# Altium schematic sheet Led_Matrix_3.SchDoc
size A3; CompanyName: Anfaengineering; Organization: Anfaengineering; Address1: Timisoara; Address2: Romania; SheetNumber: 5; SheetTotal: 5
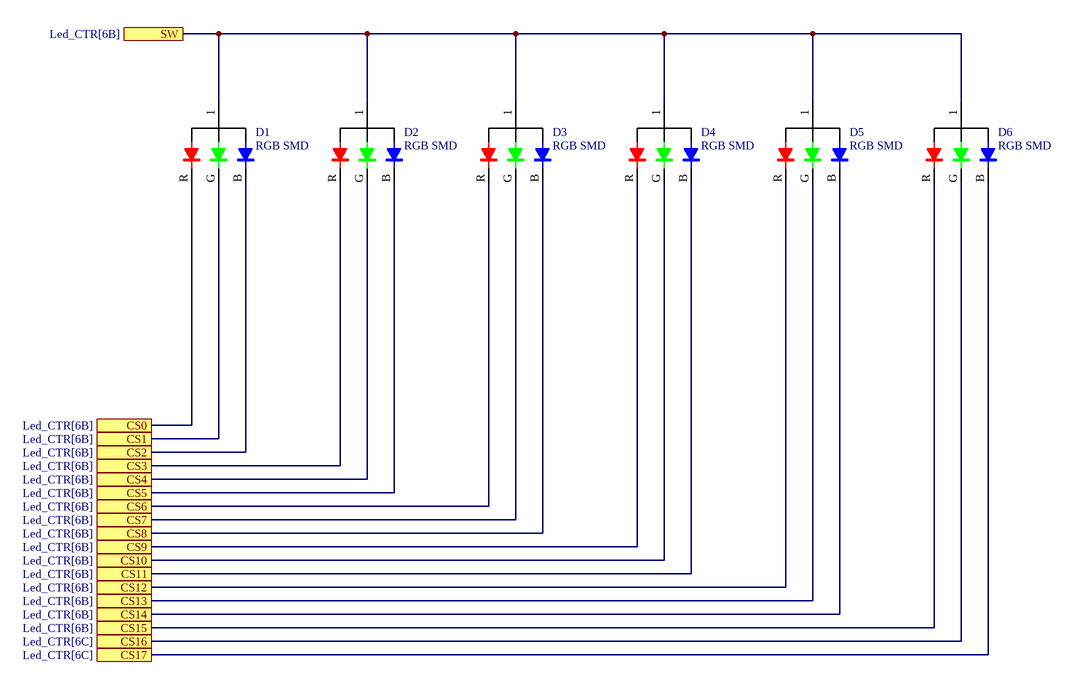
[diagram p0: Led_Matrix_3.SchDoc]

## Parts
D1  RGB SMD  [LRTB_R48G]
D2  RGB SMD  [LRTB_R48G]
D3  RGB SMD  [LRTB_R48G]
D4  RGB SMD  [LRTB_R48G]
D5  RGB SMD  [LRTB_R48G]
D6  RGB SMD  [LRTB_R48G]

## Ports
CS0 (see Led_CTR[6B]), CS1 (see Led_CTR[6B]), CS2 (see Led_CTR[6B]), CS3 (see Led_CTR[6B]), CS4 (see Led_CTR[6B]), CS5 (see Led_CTR[6B]), CS6 (see Led_CTR[6B]), CS7 (see Led_CTR[6B]), CS8 (see Led_CTR[6B]), CS9 (see Led_CTR[6B]), CS10 (see Led_CTR[6B]), CS11 (see Led_CTR[6B]), CS12 (see Led_CTR[6B]), CS13 (see Led_CTR[6B]), CS14 (see Led_CTR[6B]), CS15 (see Led_CTR[6B]), CS16 (see Led_CTR[6C]), CS17 (see Led_CTR[6C]), SW (see Led_CTR[6B])

## Nets
CS0: D1.R ; port CS0
CS1: D1.G ; port CS1
CS2: D1.B ; port CS2
CS3: D2.R ; port CS3
CS4: D2.G ; port CS4
CS5: D2.B ; port CS5
CS6: D3.R ; port CS6
CS7: D3.G ; port CS7
CS8: D3.B ; port CS8
CS9: D4.R ; port CS9
CS10: D4.G ; port CS10
CS11: D4.B ; port CS11
CS12: D5.R ; port CS12
CS13: D5.G ; port CS13
CS14: D5.B ; port CS14
CS15: D6.R ; port CS15
CS16: D6.G ; port CS16
CS17: D6.B ; port CS17
SW: D1.1 D2.1 D3.1 D4.1 D5.1 D6.1 ; port SW

## Library data of the parts
D1-D6 = LED_RGB_SMD-4PIN_LRTB-R48G: LED Tri-Color Blue/Green/Red, 4-Pin Chip, 125 mcd, 2.7V, 10mA; Manufacturer: Osram Opto; Manufacturer Part Number: LRTB R48G; Anfa_PN: QL0002; Component loss: 10; Max Luminosity: 125 mcd; LED Current: 10 mA; Max Operating Temperature: 85 °C; Min Operating Temperature: -30 °C; Price: 0.12; Supplier 1: Mouser; Supplier Part Number 1: 720-LRTBR48G; Value: RGB SMD; Voltage: 2.7 V